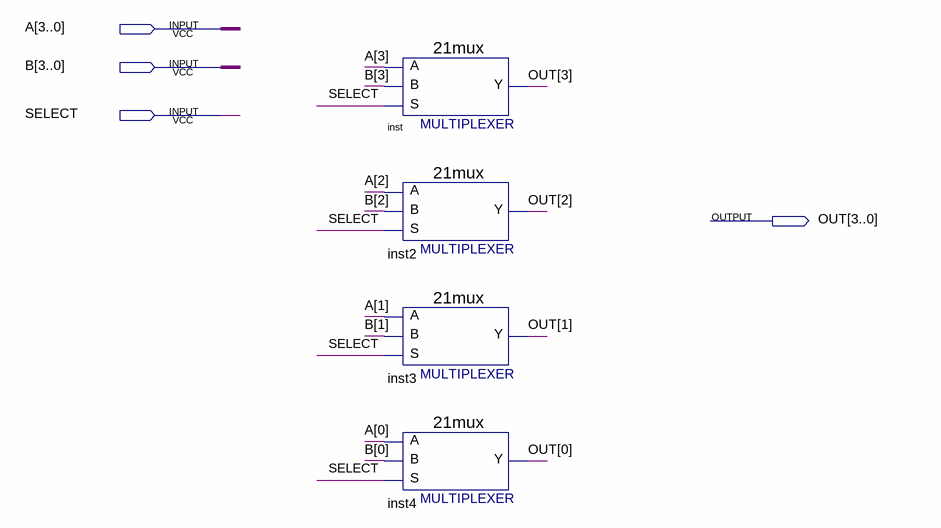
[diagram p0: schematic sheet]
// Quartus schematic MUX.bdf as structural Verilog: 4 symbols, 4 pins
module MUX (
  input  [3:0] A,
  input  [3:0] B,
  input  SELECT,
  output [3:0] OUT
);

  \21mux  inst (.S(SELECT), .B(B[3]), .A(A[3]), .Y(OUT[3]));
  \21mux  inst2 (.S(SELECT), .B(B[2]), .A(A[2]), .Y(OUT[2]));
  \21mux  inst3 (.S(SELECT), .B(B[1]), .A(A[1]), .Y(OUT[1]));
  \21mux  inst4 (.S(SELECT), .B(B[0]), .A(A[0]), .Y(OUT[0]));
endmodule
